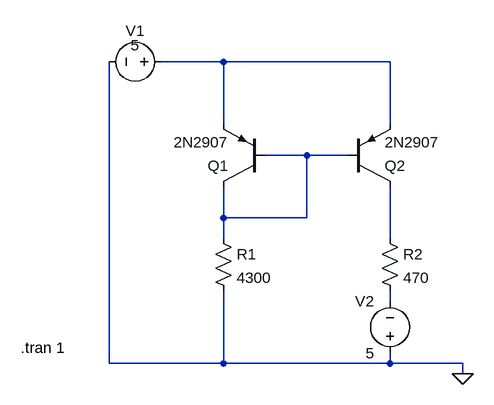
[diagram p0: schematic Task1.asc]
Task1.asc, the LTspice schematic file:
Version 4
SHEET 1 880 680
WIRE 288 64 192 64
WIRE 544 64 288 64
WIRE 288 160 288 64
WIRE 544 160 544 64
WIRE 416 208 352 208
WIRE 480 208 416 208
WIRE 288 304 288 256
WIRE 416 304 416 208
WIRE 416 304 288 304
WIRE 288 336 288 304
WIRE 544 336 544 256
WIRE 544 432 544 416
WIRE 112 528 112 64
WIRE 288 528 288 416
WIRE 288 528 112 528
WIRE 544 528 544 512
WIRE 544 528 288 528
WIRE 656 528 544 528
WIRE 656 544 656 528
FLAG 656 544 0
SYMBOL pnp 352 256 R180
SYMATTR InstName Q1
SYMATTR Value 2N2907
SYMBOL pnp 480 256 M180
SYMATTR InstName Q2
SYMATTR Value 2N2907
SYMBOL res 272 320 R0
SYMATTR InstName R1
SYMATTR Value 4300
SYMBOL res 528 320 R0
SYMATTR InstName R2
SYMATTR Value 470
SYMBOL voltage 208 64 R90
WINDOW 0 -32 56 VBottom 2
WINDOW 3 -10 56 VBottom 2
SYMATTR InstName V1
SYMATTR Value 5
SYMBOL voltage 544 528 R180
WINDOW 0 24 96 Left 2
WINDOW 3 24 16 Left 2
SYMATTR InstName V2
SYMATTR Value 5
TEXT -24 504 Left 2 !.tran 1

The netlist it stands for:
* Task1.asc
Q1 N002 N002 N001 0 2N2907
Q2 N003 N002 N001 0 2N2907
R1 N002 0 4300
R2 N003 N004 470
V1 N001 0 5
V2 0 N004 5
.model NPN NPN
.model PNP PNP
.lib standard.bjt
.tran 1
.backanno
.end